# Altium schematic sheet p4_power_measure_ch1.SchDoc
size A1; Organization: Protel International P/L; Address1: L3, 12a Rodborough Rd; Address2: Frenchs Forest; Address3: NSW; Address4: Australia 2086
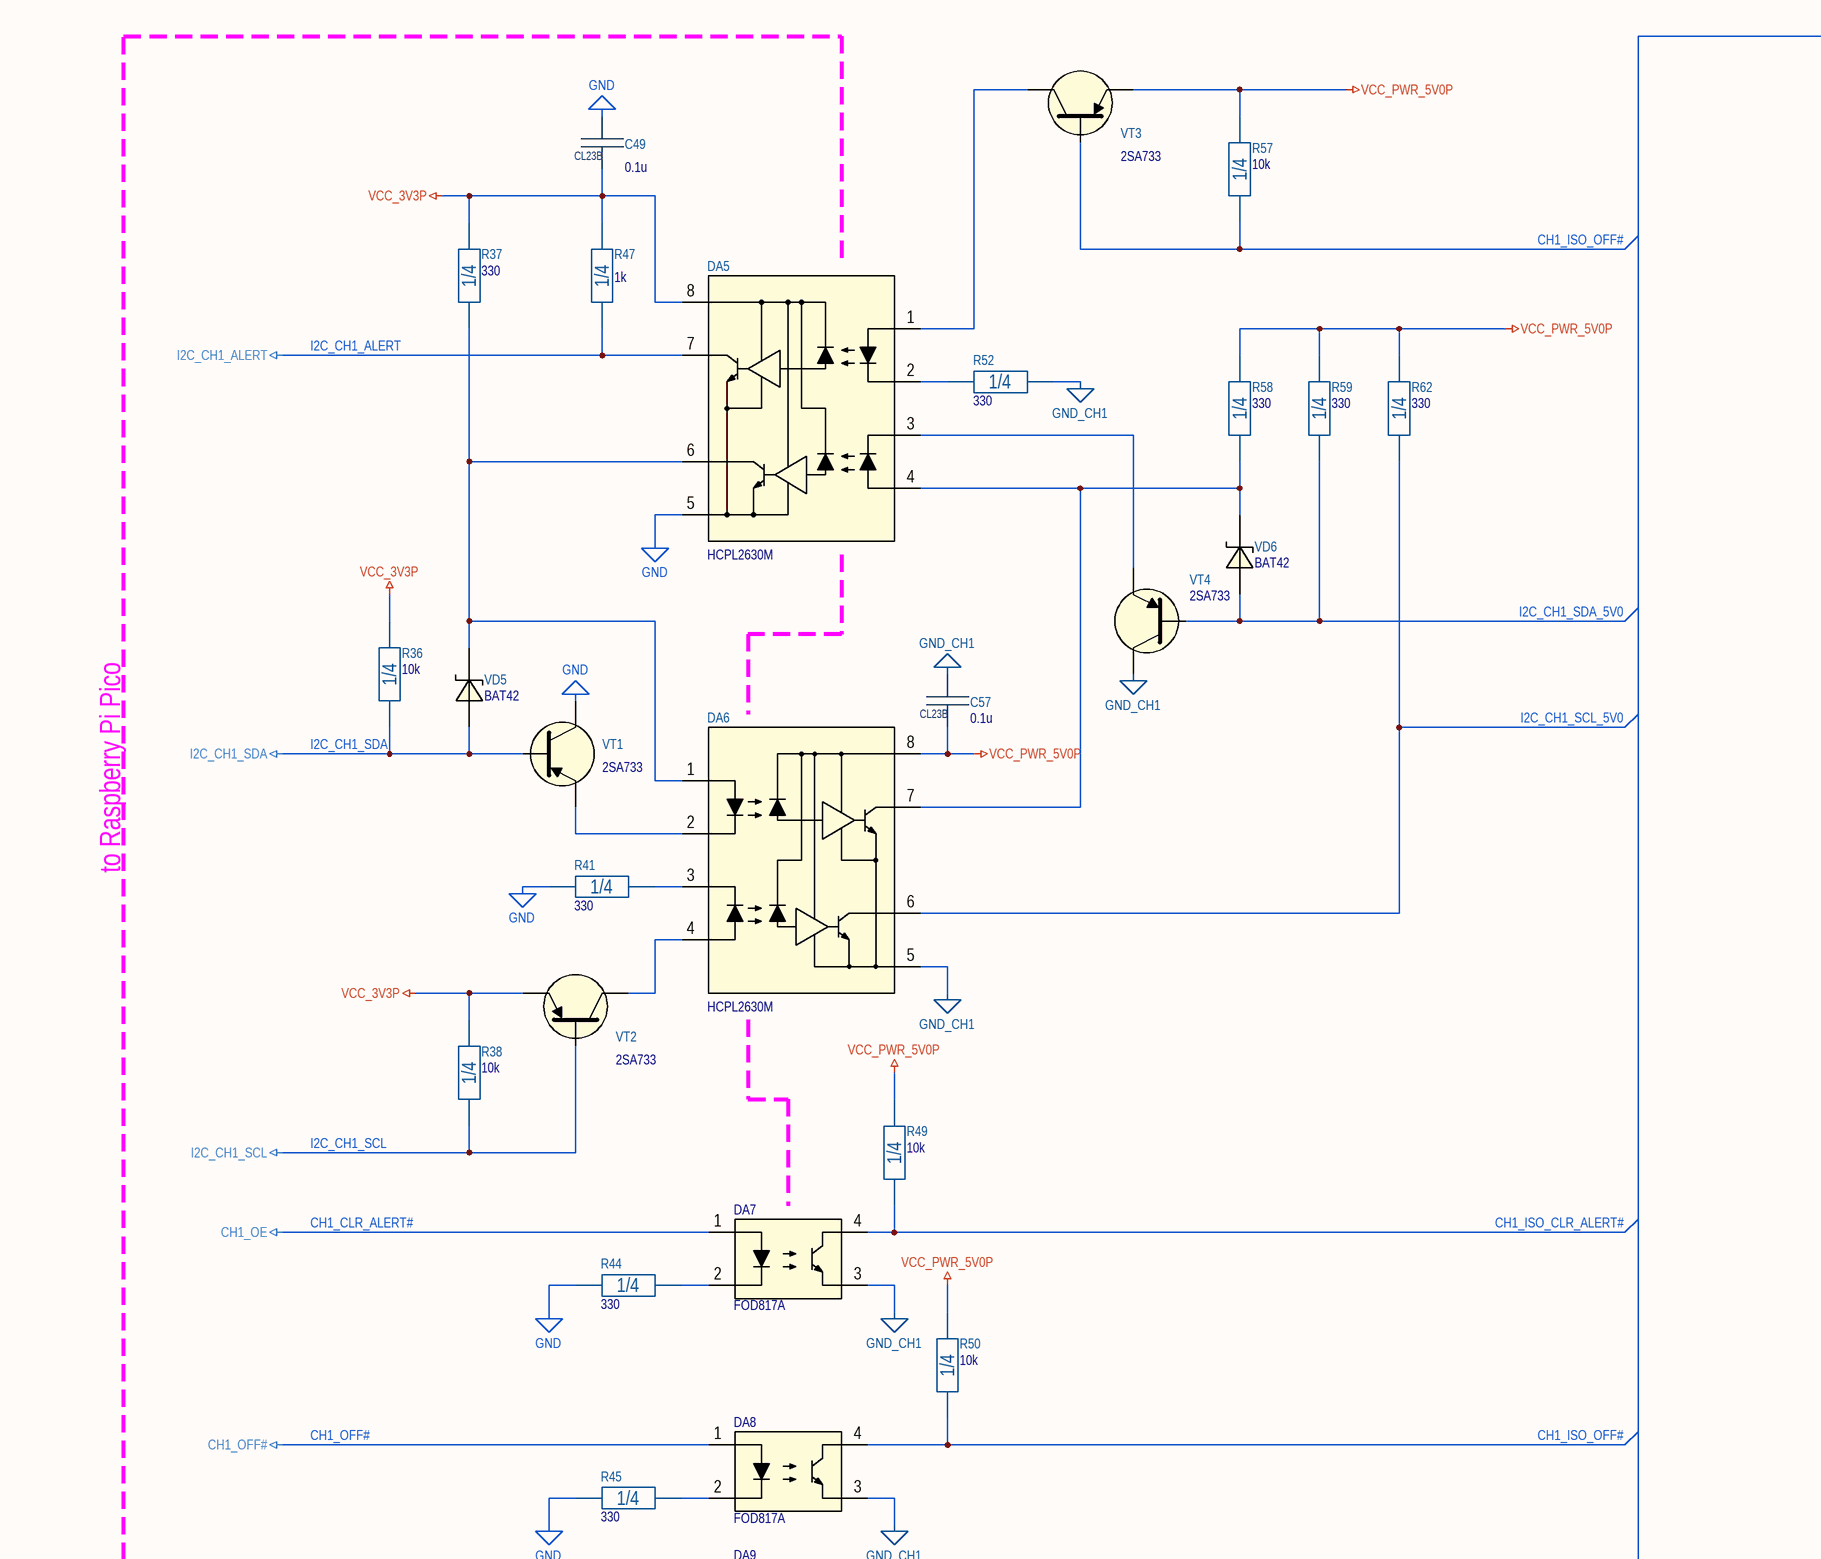
[diagram p0: p4_power_measure_ch1.SchDoc, top left]
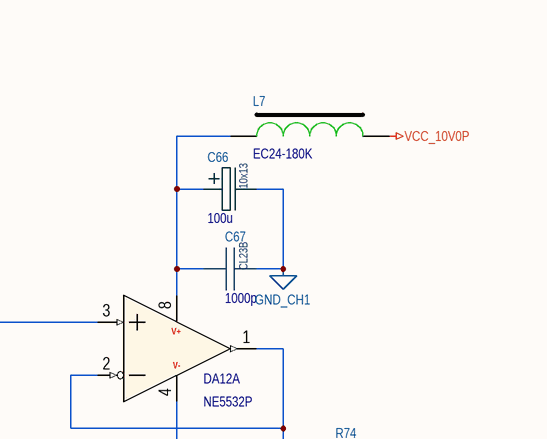
[diagram p1: p4_power_measure_ch1.SchDoc, top right]
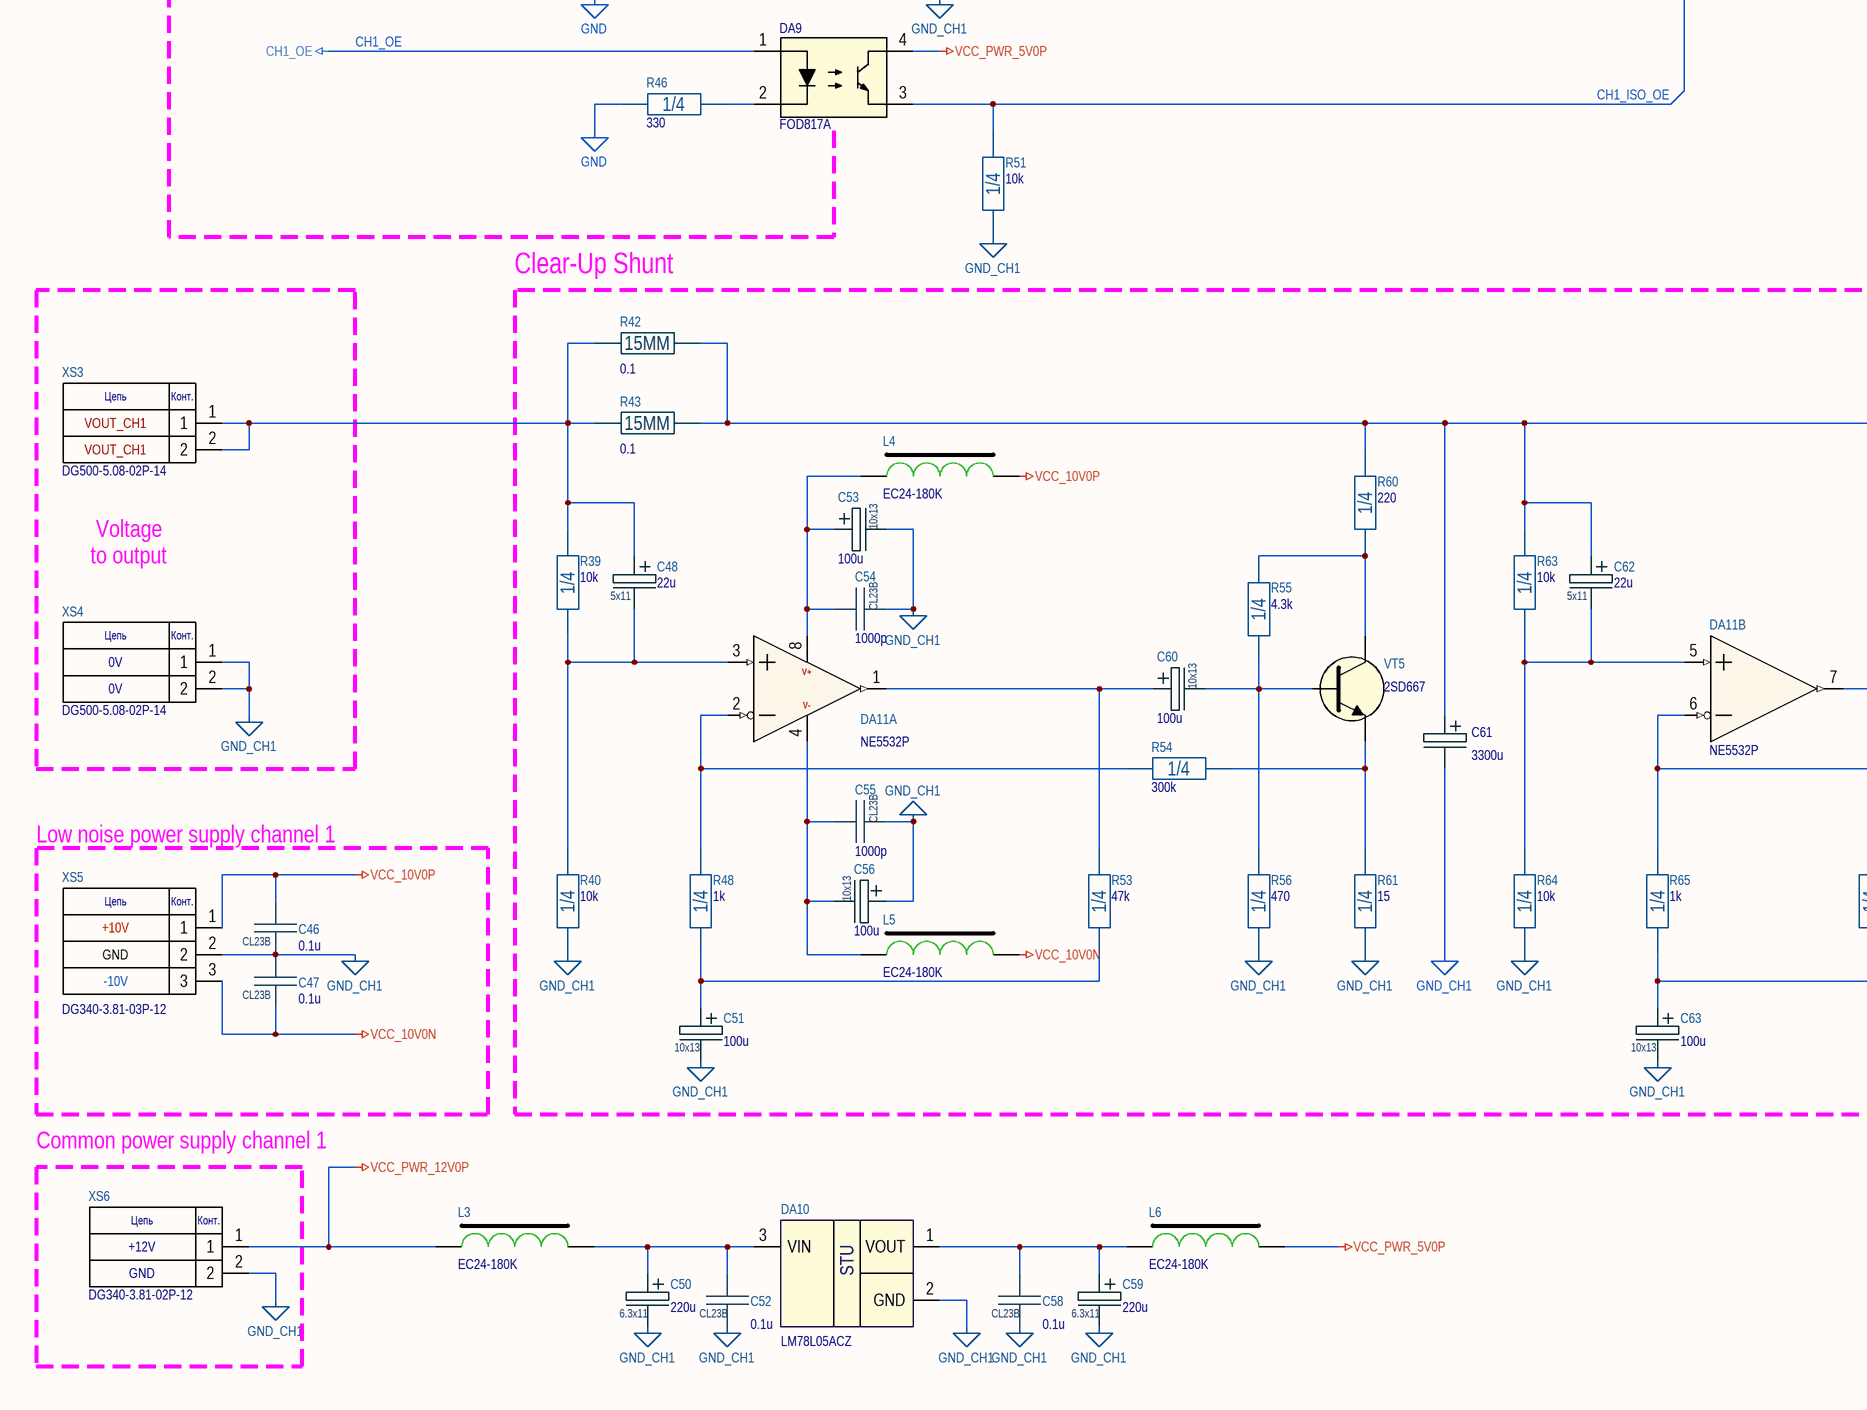
[diagram p2: p4_power_measure_ch1.SchDoc, bottom left]
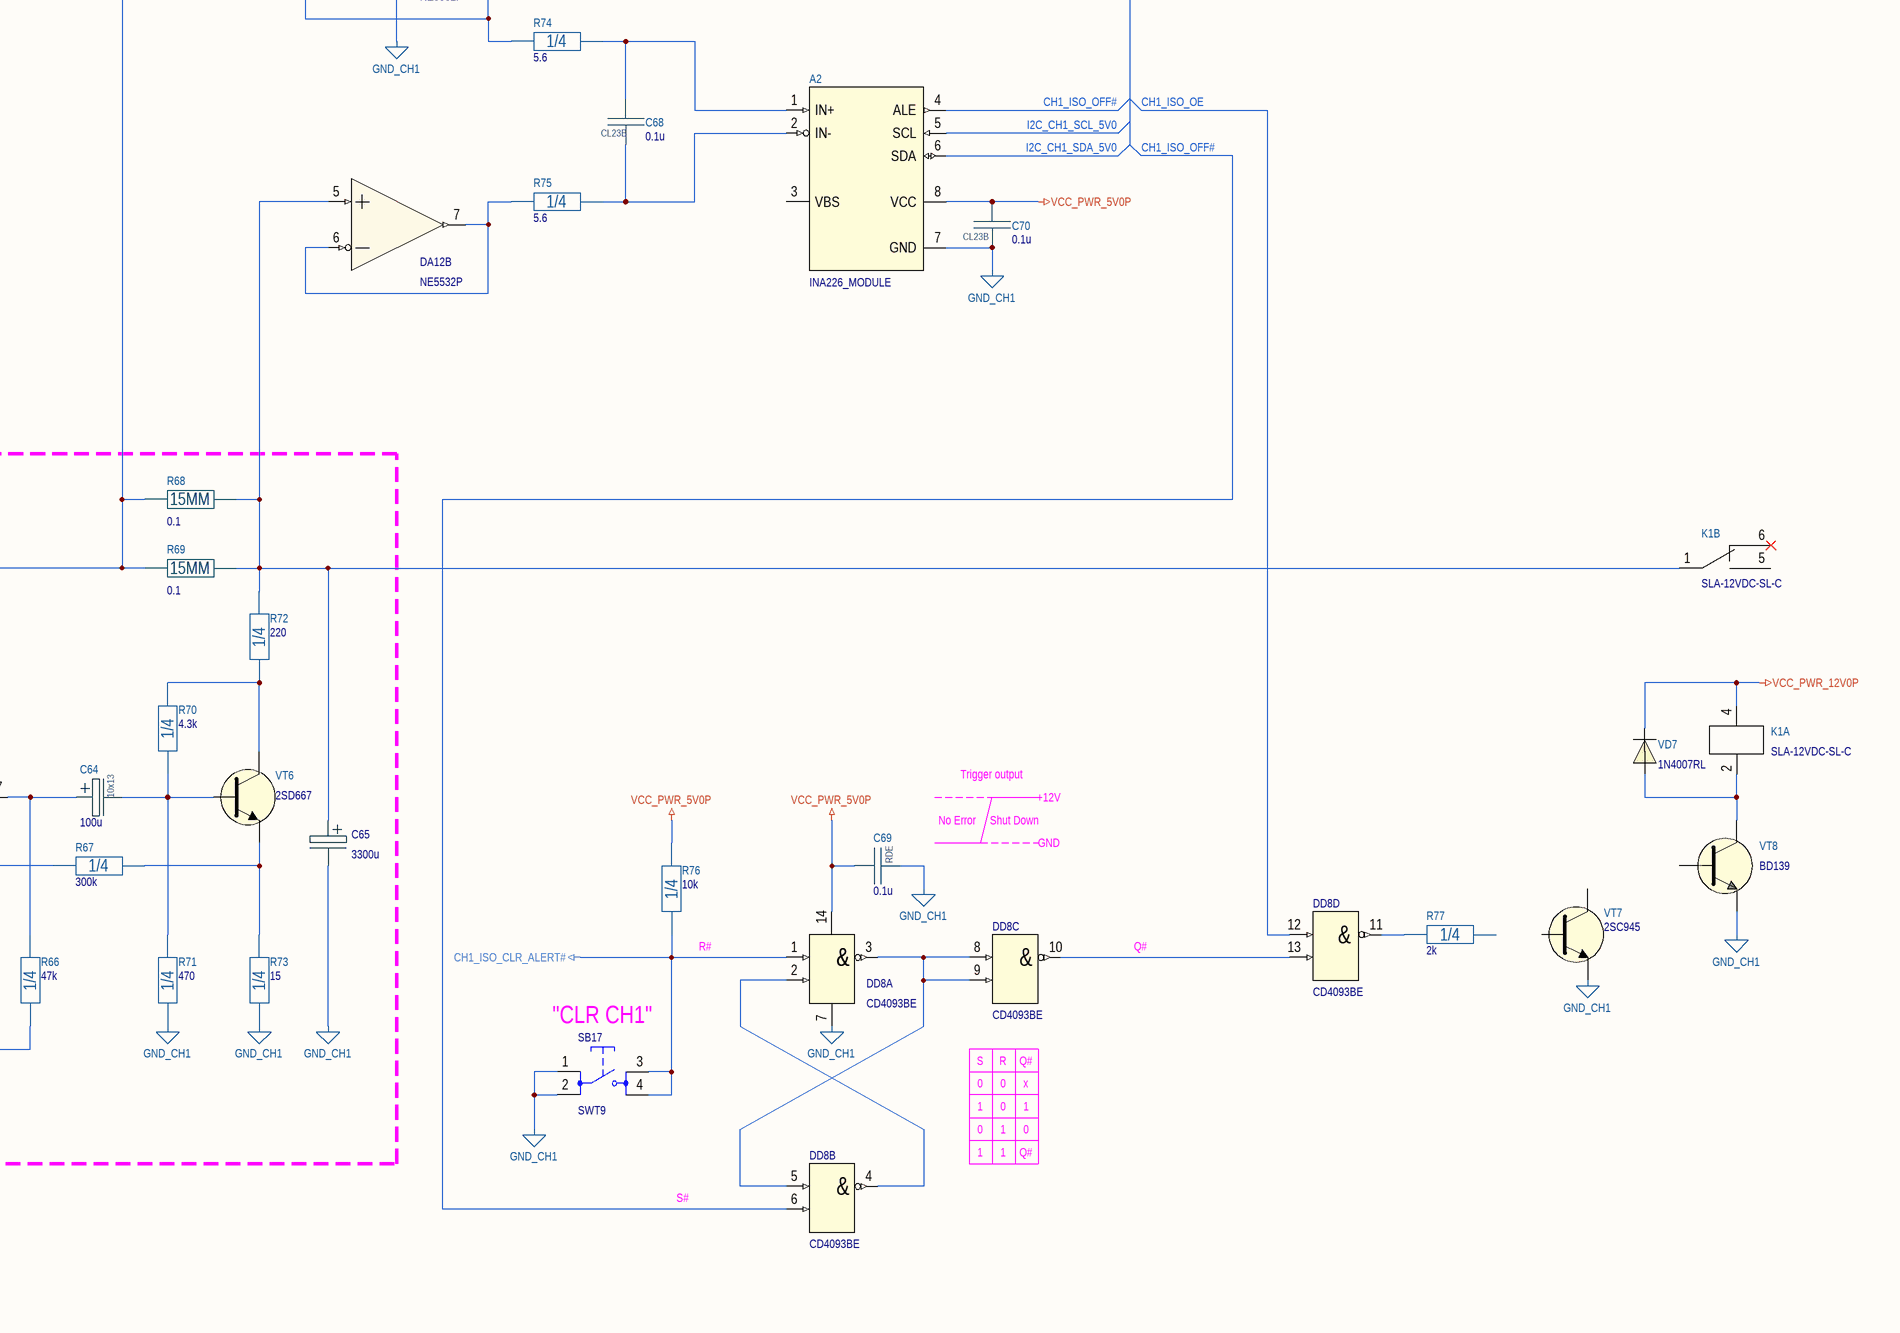
[diagram p3: p4_power_measure_ch1.SchDoc, bottom right]

## Parts
A2  INA226_MODULE  [INA226_MODULE_VERT]
C46  0.1u  [CL23B_7.2x2.5]
C47  0.1u  [CL23B_7.2x2.5]
C48  22u  Package: 5x11  [ECAP5X11X2.0_BRW]
C49  0.1u  [CL23B_7.2x2.5]
C50  220u  Package: 6.3x11  [ECAP6.3X11X2.5_BRW]
C51  100u  Package: 10x13  [ECAP10X13X5_BRW]
C52  0.1u  [CL23B_7.2x2.5]
C53  100u  Package: 10x13  [ECAP10X13X5_BRW]
C54  1000p  [CL23B_7.2x2.5]
C55  1000p  [CL23B_7.2x2.5]
C56  100u  Package: 10x13  [ECAP10X13X5_BRW]
C57  0.1u  [CL23B_7.2x2.5]
C58  0.1u  [CL23B_7.2x2.5]
C59  220u  Package: 6.3x11  [ECAP6.3X11X2.5_BRW]
C60  100u  Package: 10x13  [ECAP10X13X5_BRW]
C61  3300u  [ECAP16X36X75_BLK]
C62  22u  Package: 5x11  [ECAP5X11X2.0_BRW]
C63  100u  Package: 10x13  [ECAP10X13X5_BRW]
C64  100u  Package: 10x13  [ECAP10X13X5_BRW]
C65  3300u  [ECAP16X36X75_BLK]
C66  100u  Package: 10x13  [ECAP10X13X5_BRW]
C67  1000p  [CL23B_7.2x2.5]
C68  0.1u  [CL23B_7.2x2.5]
C69  0.1u  Package: RDE  [RDE_1P1]
C70  0.1u  [CL23B_7.2x2.5]
DA5  HCPL2630M  [DIP-8P-M01]
DA6  HCPL2630M  [DIP-8P-M01]
DA7  FOD817A  [DIP-4P]
DA8  FOD817A  [DIP-4P]
DA9  FOD817A  [DIP-4P]
DA10  LM78L05ACZ  [TO-92 (VERTICAL,LINE)]
DA11  NE5532P  [DIP-8P-M01]  (parts A,B of 2)
DA12  NE5532P  [DIP-8P-M01]  (parts A,B of 2)
DD8  CD4093BE  [DIP-14P-M02]  (parts A,B,C,D of 4)
K1  SLA-12VDC-SL-C  [RELAY_32x27.5MM]  (parts A,B of 2)
L3  EC24-180K  [EC24_GREEN]
L4  EC24-180K  [EC24_GREEN]
L5  EC24-180K  [EC24_GREEN]
L6  EC24-180K  [EC24_GREEN]
L7  EC24-180K  [EC24_GREEN]
R36  10k  Package: 1/4  [CFR-25]
R37  330  Package: 1/4  [CFR-25]
R38  10k  Package: 1/4  [CFR-25]
R39  10k  Package: 1/4  [CFR-25]
R40  10k  Package: 1/4  [CFR-25]
R41  330  Package: 1/4  [CFR-25]
R42  0.1  Package: 15MM  [CURRENT_SENSE_15x18mm]
R43  0.1  Package: 15MM  [CURRENT_SENSE_15x18mm]
R44  330  Package: 1/4  [CFR-25]
R45  330  Package: 1/4  [CFR-25]
R46  330  Package: 1/4  [CFR-25]
R47  1k  Package: 1/4  [CFR-25]
R48  1k  Package: 1/4  [CFR-25]
R49  10k  Package: 1/4  [CFR-25]
R50  10k  Package: 1/4  [CFR-25]
R51  10k  Package: 1/4  [CFR-25]
R52  330  Package: 1/4  [CFR-25]
R53  47k  Package: 1/4  [CFR-25]
R54  300k  Package: 1/4  [CFR-25]
R55  4.3k  Package: 1/4  [CFR-25]
R56  470  Package: 1/4  [CFR-25]
R57  10k  Package: 1/4  [CFR-25]
R58  330  Package: 1/4  [CFR-25]
R59  330  Package: 1/4  [CFR-25]
R60  220  Package: 1/4  [CFR-25]
R61  15  Package: 1/4  [CFR-25]
R62  330  Package: 1/4  [CFR-25]
R63  10k  Package: 1/4  [CFR-25]
R64  10k  Package: 1/4  [CFR-25]
R65  1k  Package: 1/4  [CFR-25]
R66  47k  Package: 1/4  [CFR-25]
R67  300k  Package: 1/4  [CFR-25]
R68  0.1  Package: 15MM  [CURRENT_SENSE_15x18mm]
R69  0.1  Package: 15MM  [CURRENT_SENSE_15x18mm]
R70  4.3k  Package: 1/4  [CFR-25]
R71  470  Package: 1/4  [CFR-25]
R72  220  Package: 1/4  [CFR-25]
R73  15  Package: 1/4  [CFR-25]
R74  5.6  Package: 1/4  [CFR-25(VERTICAL)]
R75  5.6  Package: 1/4  [CFR-25(VERTICAL)]
R76  10k  Package: 1/4  [CFR-25]
R77  2k  Package: 1/4  [CFR-25]
SB17  SWT9  [SWT9]
VD5  BAT42  [DO-35 GLASS BLUE]
VD6  BAT42  [DO-35 GLASS BLUE]
VD7  1N4007RL  [DO-41]
VT1  2SA733  [TO-92 (VERTICAL,LINE)]
VT2  2SA733  [TO-92 (VERTICAL,LINE)]
VT3  2SA733  [TO-92 (VERTICAL,LINE)]
VT4  2SA733  [TO-92 (VERTICAL,LINE)]
VT5  2SD667  [TO-92L (VERTICAL,LINE)]
VT6  2SD667  [TO-92L (VERTICAL,LINE)]
VT7  2SC945  [TO-92 (VERTICAL,LINE)]
VT8  BD139  [TO-126 (VERTICAL)]
XS3  DG500-5.08-02P-14  [DG500-5.08-02P]
XS4  DG500-5.08-02P-14  [DG500-5.08-02P]
XS5  DG340-3.81-03P-12  [DG340-3.81-03P]
XS6  DG340-3.81-02P-12  [DG340-3.81-02P]

## Blocks framed on the sheet
Low noise power supply channel 1: C46 C47 XS5

## Nets
CH1_CLR_ALERT#: DA7.1(ANODE) DA9.1(ANODE)  [also labelled CH1_OE]
CH1_ISO_CLR_ALERT#: DA7.4(COLLECTOR) DD8.1(A0) R49.1 R76.1 SB17.3 SB17.4
CH1_OFF#: DA8.1(ANODE)
GND: C49.1 DA5.5(GND) R41.1 R44.1 R45.1 R46.1 VT1.2(C)
GND_CH1: A2.7(GND) C46.2 C47.1 C50.2 C51.2 C52.2 C53.2 C54.2 C55.2 C56.1 C57.1 C58.2 C59.2 C61.2 C63.2 C65.2 C66.2 C67.2 C69.2 C70.2 DA6.5(GND) DA7.3(EMITTER) DA8.3(EMITTER) DA10.2(GND) DA12.4(GND) DD8.7(GND) R40.1 R51.1 R52.2 R56.1 R61.1 R64.1 R71.1 R73.1 SB17.1 SB17.2 VT4.2(C) VT7.3(E) VT8.3(E) XS4.1 XS4.2 XS5.2 XS6.2
I2C_CH1_ALERT: DA5.7(V01) R47.2
I2C_CH1_SCL: R38.1 VT2.1(B)
I2C_CH1_SDA: R36.1 VD5.2(ANODE) VT1.1(B)
VCC_3V3P: C49.2 DA5.8(VCC) R36.2 R37.1 R38.2 R47.1 VT2.3(E)
VCC_10V0N: C47.2 L5.2 XS5.3
VCC_10V0P: C46.1 L4.2 L7.2 XS5.1
VCC_PWR_5V0P: A2.8(VCC) C57.2 C69.1 C70.1 DA6.8(VCC) DA9.4(COLLECTOR) DD8.14(VCC) L6.2 R49.2 R50.2 R57.2 R58.1 R59.1 R62.1 R76.2 VT3.3(E)
VCC_PWR_12V0P: K1.4 L3.1 VD7.1(C) XS6.1
CH1_ISO_OE: DA9.3(EMITTER) DD8.12(A3) R51.2
CH1_ISO_OFF#: A2.4(ALE) DA8.4(COLLECTOR) DD8.6(B1) R50.1 R57.1 VT3.1(B)
I2C_CH1_SCL_5V0: A2.5(SCL) DA6.6(V02) R62.2
I2C_CH1_SDA_5V0: A2.6(SDA) R59.2 VD6.2(ANODE) VT4.1(B)
NetA2_1: A2.1(IN+) C68.2 R74.2
NetA2_2: A2.2(IN-) C68.1 R75.2
NetC48_1: C48.1 R39.2 R42.1 R43.1 XS3.1 XS3.2
NetC48_2: C48.2 DA11.3(1IN+) R39.1 R40.2
NetC50_1: C50.1 C52.1 DA10.3(VIN) L3.2
NetC51_1: C51.1 R48.1 R53.1
NetC53_1: C53.1 C54.1 DA11.8(VCC) L4.1
NetC55_1: C55.1 C56.2 DA11.4(GND) L5.1
NetC58_1: C58.1 C59.1 DA10.1(VOUT) L6.1
NetC60_1: C60.1 DA11.1(1OUT) R53.2
NetC60_2: C60.2 R55.1 R56.2 VT5.3(B)
NetC61_1: C61.1 C62.1 DA12.3(1IN+) R42.2 R43.2 R60.2 R63.2 R68.1 R69.1
NetC62_2: C62.2 DA11.5(2IN+) R63.1 R64.2
NetC63_1: C63.1 R65.1 R66.1
NetC64_1: C64.1 DA11.7(2OUT) R66.2
NetC64_2: C64.2 R70.1 R71.2 VT6.3(B)
NetC65_1: C65.1 DA12.5(2IN+) K1.1 R68.2 R69.2 R72.2
NetC66_1: C66.1 C67.1 DA12.8(VCC) L7.1
NetDA5_1: DA5.1(ANODE1) VT3.2(C)
NetDA5_2: DA5.2(CATHODE1) R52.1
NetDA5_3: DA5.3(CATHODE2) VT4.3(E)
NetDA5_4: DA5.4(ANODE2) DA6.7(V01) R58.2 VD6.1(CATHODE)
NetDA5_6: DA5.6(V02) DA6.1(ANODE1) R37.2 VD5.1(CATHODE)
NetDA6_2: DA6.2(CATHODE1) VT1.3(E)
NetDA6_3: DA6.3(CATHODE2) R41.2
NetDA6_4: DA6.4(ANODE2) VT2.2(C)
NetDA7_2: DA7.2(CATHODE) R44.2
NetDA8_2: DA8.2(CATHODE) R45.2
NetDA9_2: DA9.2(CATHODE) R46.2
NetDA11_2: DA11.2(1IN-) R48.2 R54.2
NetDA11_6: DA11.6(2IN-) R65.2 R67.2
NetDA12_1: DA12.1(1OUT) DA12.2(1IN-) R74.1
NetDA12_6: DA12.6(2IN-) DA12.7(2OUT) R75.1
NetDD8_2: DD8.2(B0) DD8.4(Y1)
NetDD8_3: DD8.3(Y0) DD8.5(A1) DD8.8(A2) DD8.9(B2)
NetDD8_10: DD8.10(Y2) DD8.13(B3)
NetDD8_11: DD8.11(Y3) R77.1
NetK1_2: K1.2 VD7.2(A) VT8.2(C)
NetR54_1: R54.1 R61.2 VT5.1(E)
NetR55_2: R55.2 R60.1 VT5.2(C)
NetR67_1: R67.1 R73.2 VT6.1(E)
NetR70_2: R70.2 R72.1 VT6.2(C)

Not connected (* = marked no-connect by the designer): A2 3(VBS); K1 5 6*; R77 2; VT7 1(B) 2(C); VT8 1(B)

## Notes on the sheet
- to Raspberry Pi Pico
- Clear-Up Shunt
- (near XS3) VOUT_CH1
- Voltage
- to output
- 0V
- No Error
- Trigger output
- Shut Down
- +12V
- GND
- (near R76) R#
- Q#
- +10V
- -10V
- (near SB17) "CLR CH1"
- S
- 0
- 1
- R
- x
- Common power supply channel 1
- S#
- Title
- Size:
- Date:
- File:
- A1
- Number:
- Time:
- Revision:
- Sheet
- of
- (in symbol CD4093BE, part A) &
- (in symbol CD4093BE, part B) &
- (in symbol CD4093BE, part C) &
- (in symbol CD4093BE, part D) &
- (in symbol DG340-3.81-02P-12) Цепь; Конт.
- (in symbol DG340-3.81-03P-12) Цепь; Конт.
- (in symbol DG500-5.08-02P-14) Цепь; Конт.
- (in symbol LM78L05ACZ) STU
- (in symbol NE5532P, part A) V+; V-

## Library data of the parts
A2 = INA226_MODULE: 20x20mm module with INA226; Part Number: INA226_MODULE
C46 C47 C49 C52 C54 C55 C57 C58 C67 C68 C70 = CL23B: Box-type metallized polyester film capacitor; Tolerance: ± * %; Voltage: 63V; Dielectric: Polyester; Part Number: *; Manufacturer: *; Package: CL23B
  C46 C47 C49 C52 C57 C58 C68 C70: Value: 0.1u; Value on schem: 0.1u
  C54 C55 C67: Value: 1000p; Value on schem: 1000p
C48 C62 = C_ECAP: Aluminium capacitor; Part Number: UVR1J220MDD; Manufacturer: Nichicon; Tolerance: ± 20 %; Voltage: 63V; Value: 22u; Value on schem: 22u
C50 C59 = C_ECAP: Aluminium capacitor; Part Number: EKZH160ELL221MF11D; Manufacturer: Nichicon; Tolerance: ± 20 %; Voltage: 16V; Value: 220u; Value on schem: 220u
C51 C53 C56 C60 C63 C64 C66 = C_ECAP: Aluminium capacitor; Manufacturer: Nichicon; Tolerance: ± 20 %; Voltage: 63V; Value: 100u; Value on schem: 100u
C61 C65 = C_ECAP: Aluminium capacitor; Part Number: RD1H338M1635MPA; Manufacturer: Samwha; Tolerance: ± 20 %; Voltage: 50V; Value: 3300u; Value on schem: 3300u; Package: 16x36
C69 = RDE_CAP: MLCC radial lead type with epoxy coat (RDE Series); Part Number: RDER72A104K1P1H03B; Manufacturer: Murata; Tolerance: ± 10 %; Dielectric: X7R; Voltage: 100V; Value: 0.1u; Value on schem: 0.1u
DA5 DA6 = HCPL2630M: Dual-Channel High-Speed 10 MBit/s Logic Gate Optocouplers; Manufacturer: ON Semiconductor; Package: DIP-8; Part Number: HCPL2630M
DA7-DA9 = FOD817A: 5kV Phototransistor Optocoupler; Manufacturer: ON Semiconductor; Package: DIP-4; Part Number: FOD817A
DA10 = LM78L05ACZ: 100-mA Fixed Output Linear Regulator; Manufacturer: Texas Instruments; Part Number: LM78L05ACZ; Package: TO-92
DA11 DA12 = NE5532P: DUAL LOW-NOISE OPERATIONAL AMPLIFIERS; Manufacturer: Texas Instruments; Part Number: NE5532P; Package: DIP-8
DD8 = CD4093BE: Quad 2-Input NAND Gate Schmitt Triggers; Manufacturer: Texas Instruments; Part Number: CD4093BE; Package: DIP-14
K1 = SLA-12VDC-SL-C: Subminature high power relay 4P 30A; Manufacturer: Songle Relay; Coil Power Dissipation: 0.9W; Coil Current: 12V@75mA; Coil Resistance: 160 Ohm; Package: 32mm x27.5mm; Part Number: SLA-12VDC-SL-C
L3-L7 = EC24: Axial leaded coated inductors; Manufacturer: 3L Electronic; RDC: 1 Ohm; SRF Min: 15 MHz; Q: 40; Irms  Max: 315 mA; Inductance @ 100 kHz: 18 µH; Part Number: EC24-180K; Package: EC24
R36 R38-R40 R49-R51 R57 R63 R64 R76 = CF25: Resistor 1/4W; Part Number: MFR-25FTF52-10K; Manufacturer: Yageo; Tolerance: ± 1 %; Voltage: 250V; Temperature Coefficient: ±100 ppm/°C; Value: 10k; Value on schem: 10k
R37 R41 R44-R46 R52 R58 R59 R62 = CF25: Resistor 1/4W; Part Number: MFR-25FTF52-330R; Manufacturer: Yageo; Tolerance: ± 1 %; Voltage: 250V; Temperature Coefficient: ±100 ppm/°C; Value: 330; Value on schem: 330
R42 R43 R68 R69 = SHUNT_15MM: Constantan shunt resistor, pitch = 15mm; Tolerance: ±  %; Temperature Coefficient: ±*/°C; Value: 0.1; Value on schem: 0.1; Part Number: *; Manufacturer: *; Voltage: *
R47 R48 R65 = CF25: Resistor 1/4W; Part Number: MFR-25FTF52-1K; Manufacturer: Yageo; Tolerance: ± 1 %; Voltage: 250V; Temperature Coefficient: ±100 ppm/°C; Value: 1k; Value on schem: 1k
R53 R66 = CF25: Resistor 1/4W; Part Number: MFR-25FTF52-47K; Manufacturer: Yageo; Tolerance: ± 1 %; Voltage: 250V; Temperature Coefficient: ±100 ppm/°C; Value: 47k; Value on schem: 47k
R54 R67 = CF25: Resistor 1/4W; Part Number: MFR-25FTF52-300K; Manufacturer: Yageo; Tolerance: ± 1 %; Voltage: 250V; Temperature Coefficient: ±100 ppm/°C; Value: 300k; Value on schem: 300k
R55 R70 = CF25: Resistor 1/4W; Part Number: MFR-25FTF52-4K3; Manufacturer: Yageo; Tolerance: ± 1 %; Voltage: 250V; Temperature Coefficient: ±100 ppm/°C; Value: 4.3k; Value on schem: 4.3k
R56 R71 = CF25: Resistor 1/4W; Part Number: MFR-25FTF52-470R; Manufacturer: Yageo; Tolerance: ± 1 %; Voltage: 250V; Temperature Coefficient: ±100 ppm/°C; Value: 470; Value on schem: 470
R60 R72 = CF25: Resistor 1/4W; Part Number: MFR-25FTF52-220R; Manufacturer: Yageo; Tolerance: ± 1 %; Voltage: 250V; Temperature Coefficient: ±100 ppm/°C; Value: 220; Value on schem: 220
R61 R73 = CF25: Resistor 1/4W; Part Number: MFR-25FTF52-15R; Manufacturer: Yageo; Tolerance: ± 1 %; Voltage: 250V; Temperature Coefficient: ±100 ppm/°C; Value: 15; Value on schem: 15
R74 R75 = CF25: Resistor 1/4W; Part Number: MFR-25FTF52-5R6; Manufacturer: Yageo; Tolerance: ± 1 %; Voltage: 250V; Temperature Coefficient: ±100 ppm/°C; Value: 5.6; Value on schem: 5.6
R77 = CF25: Resistor 1/4W; Part Number: MFR-25FTF52-2K; Manufacturer: Yageo; Tolerance: ± 1 %; Voltage: 250V; Temperature Coefficient: ±100 ppm/°C; Value: 2k; Value on schem: 2k
SB17 = SWT9: Tact Button (with tact cap SWT9S); Part Number: SWT9
VD5 VD6 = BAT42: Small signal schottky diode 30V @ 200mA; Manufacturer: STMicroelectronics; Package: DO-35; Part Number: BAT42
VD7 = 1N4007RL: 1A 1000V Standard Recovery Rectifiers Diode; Manufacturer: ON Semiconductor; Part Number: 1N4007RL; Package: DO-41
VT1-VT4 = 2SA733: General Purpose p-n-p Transistors; Manufacturer: NEC; Package: TO-92; Part Number: 2SA733
VT5 VT6 = 2SD667: General Purpose n-p-n Transistors 120V, 1A; Manufacturer: Secos; Package: TO-92L; Part Number: 2SD667
VT7 = 2SC945: General Purpose n-p-n Transistors; Manufacturer: NEC; Package: TO-92; Part Number: 2SC945
VT8 = BD139: General Purpose n-p-n Transistors; Manufacturer: STMicroelectronics; Package: TO-126; Part Number: BD139
XS3 XS4 = DG500-5.08-02P-14: 2-way screw terminal, pitch 200mils (5.08mm); Manufacturer: DEGSON; Part Number: DG500-5.08-02P-14
XS5 = DG340-3.81-03P-12: 3-way screw terminal, pitch 150mils (3.81mm); Manufacturer: DEGSON; Part Number: DG340-3.81-03P-12
XS6 = DG340-3.81-02P-12: 2-way screw terminal, pitch 150mils (3.81mm); Manufacturer: DEGSON; Part Number: DG340-3.81-02P-12